# EAGLE design BQ24171_DC (EAGLE 6.6.0)
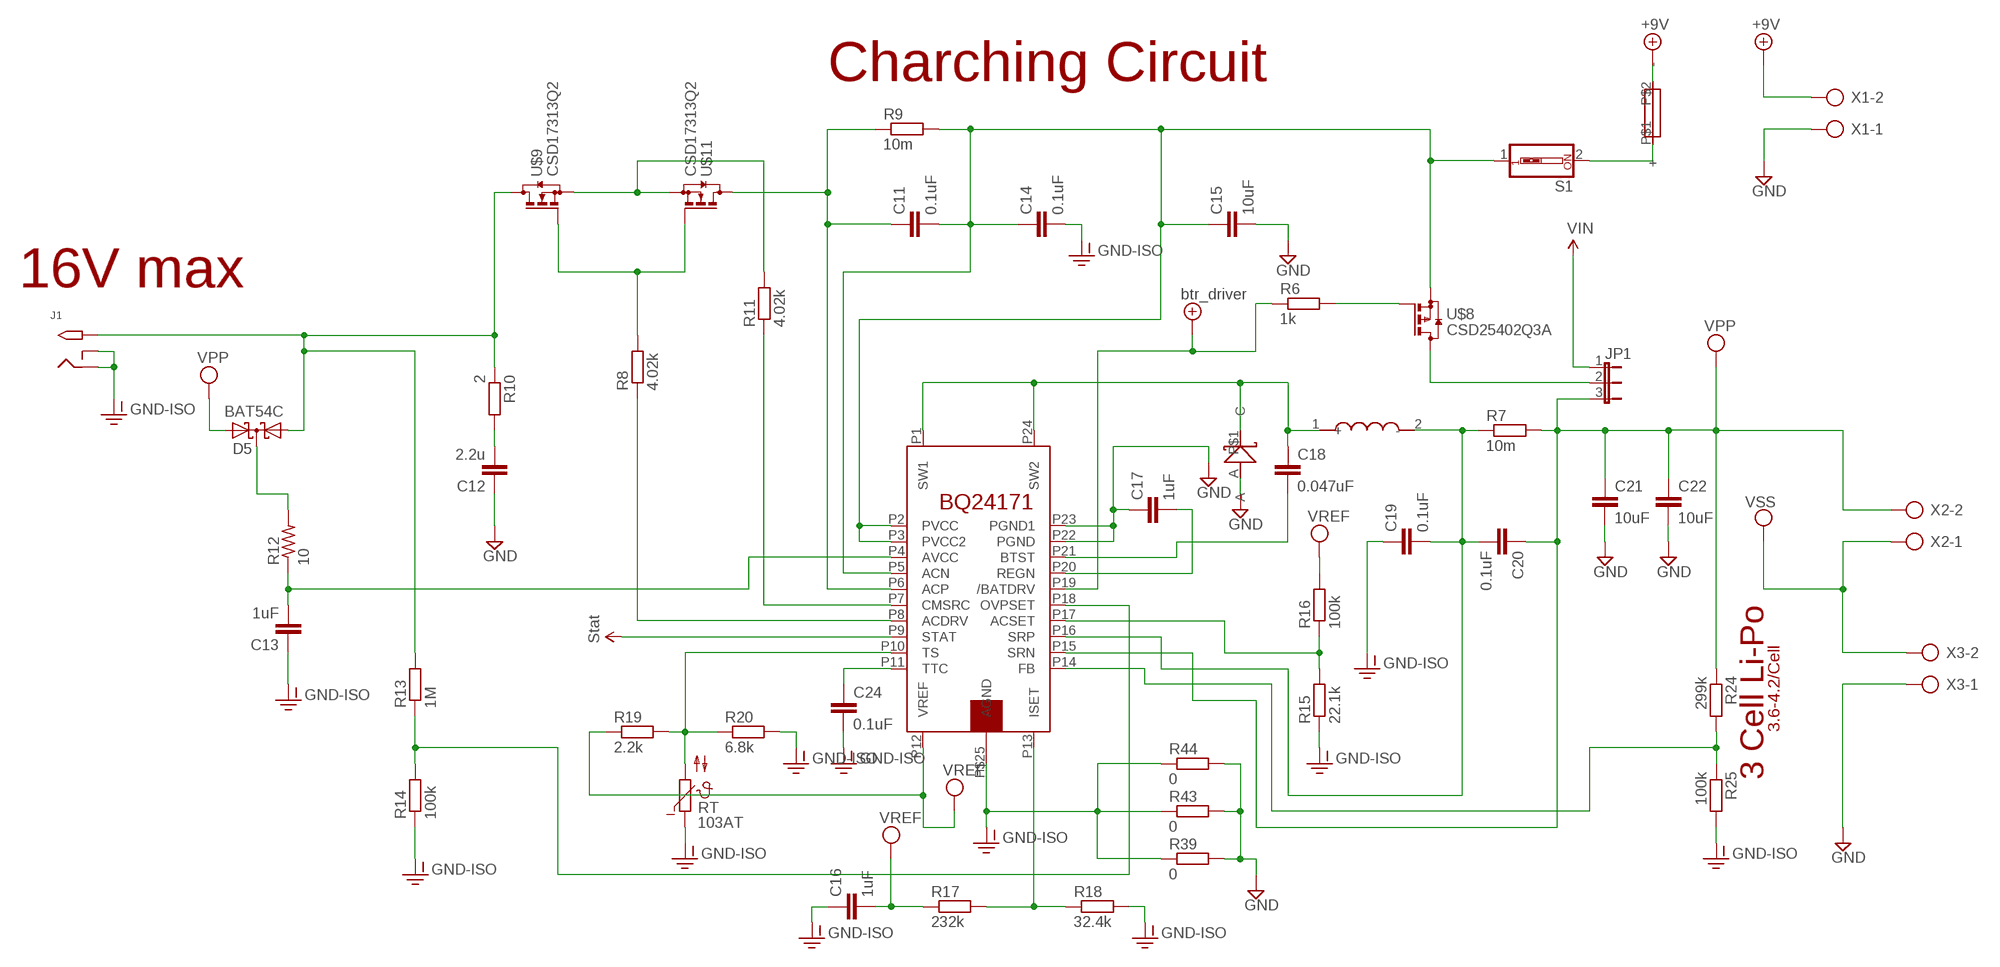
[diagram p0: schematic, sheet 1]

## Parts
B220-1  B220  [SMA]
C11  0.1uF  C-EUC1206  [C1206]
C12  2.2u  C-EUC1206  [C1206]
C13  1uF  C-EUC1206  [C1206]
C14  0.1uF  C-EUC1206  [C1206]
C15  10uF  C-EUC1206  [C1206]
C16  1uF  C-EUC1206  [C1206]
C17  1uF  C-EUC1206  [C1206]
C18  0.047uF  C-EUC1206  [C1206]
C19  0.1uF  C-EUC1206  [C1206]
C20  0.1uF  C-EUC1206  [C1206]
C21  10uF  C-EUC1206  [C1206]
C22  10uF  C-EUC1206  [C1206]
C24  0.1uF  C-EUC1206  [C1206]
D5  BAT54C  [SOT23]
J1  2.1MMJACKTHM  [PJ-102A]
JP1  JP2E  [JP2]
R6  1k  R-EU_M1206  [M1206]
R7  10m  R-EU_R1206  [R1206]
R8  4.02k  R-EU_R1206  [R1206]
R9  10m  R-EU_R1206  [R1206]
R10  2  R-EU_R1206  [R1206]
R11  4.02k  R-EU_R1206  [R1206]
R12  10  R-US_R1206  [R1206]
R13  1M  R-EU_R1206  [R1206]
R14  100k  R-EU_R1206  [R1206]
R15  22.1k  R-EU_R1206  [R1206]
R16  100k  R-EU_M1206  [M1206]
R17  232k  R-EU_R1206  [R1206]
R18  32.4k  R-EU_M1206  [M1206]
R19  2.2k  R-EU_R1206  [R1206]
R20  6.8k  R-EU_R1206  [R1206]
R24  299k  R-EU_R1206  [R1206]
R25  100k  R-EU_R1206  [R1206]
R39  0  R-EU_R1206  [R1206]
R43  0  R-EU_R1206  [R1206]
R44  0  R-EU_R1206  [R1206]
RT  103AT  NTC640  [P640]
S1  SW_DIP-1  [EDG-01]
U$5  BQ24171  [VQFN-N24]
U$7  3.3uH  IHLP-2020CZ-01  [IHLP-202CZ-01]
U$8  CSD25402Q3A  [Q3A]
U$9  CSD17313Q2  [Q2]
U$11  CSD17313Q2  [Q2]
U$17  FUSE  [1808]
X1  AK300/2  [AK300/2]
X2  AK300/2  [AK300/2]
X3  AK300/2  [AK300/2]

## Nets
1.0V: U$5.P9(STAT) ; supply symbol labelled Stat
+9V: U$17.P$2(-) X1.2
+UB: R6.1 U$5.P19(/BATDRV) ; supply symbol labelled btr_driver
AVCC: C13.2 R12.1 U$5.P4(AVCC)
BTST: C18.2 U$5.P21(BTST)
FB: R24.2 R25.1 U$5.P14(FB)
GND: B220-1.A C12.1 C15.2 C17.1 C21.2 C22.2 R39.2 R43.2 R44.2 U$5.P22(PGND) U$5.P23(PGND1) X1.1 X3.1
GND-ISO: C13.1 C14.2 C16.1 C19.1 C24.2 J1.RING J1.RING_SW R14.1 R15.1 R18.2 R20.2 R25.2 R39.1 R43.1 R44.1 RT.1 U$5.P$25(AGND)
ISET: R17.2 R18.1 U$5.P13(ISET)
N$21: JP1.2 U$8.1(D) U$8.2(D) U$8.3(D)
N$25: D5.1(A1) J1.TIP R10.1 R13.2 U$9.1(D) U$9.2(D) U$9.5(D) U$9.6(D) U$9.8(D)
N$28: R15.2 R16.1 U$5.P17(ACSET)
N$30: C11.2 C14.1 C15.1 R9.2 S1.1 U$5.P2(PVCC) U$5.P3(PVCC2) U$5.P5(ACN) U$8.5(S) U$8.6(S) U$8.7(S) U$8.8(S) U$8.P$5(S)
N$32: R6.2 U$8.4(G)
N$38: B220-1.P$1(C) C18.1 U$5.P1(SW1) U$5.P24(SW2) U$7.1(+)
N$40: C19.2 C20.2 R7.1 U$5.P16(SRP) U$7.2(-)
N$42: R8.2 U$9.3(G) U$11.3(G)
N$43: R8.1 U$5.P8(ACDRV)
N$44: R11.2 U$9.4(S) U$9.7(S) U$11.4(S) U$11.7(S)
N$45: C11.1 R9.1 U$5.P6(ACP) U$11.1(D) U$11.2(D) U$11.5(D) U$11.6(D) U$11.8(D)
N$46: C12.2 R10.2
N$48: R11.1 U$5.P7(CMSRC)
N$49: R19.2 R20.1 RT.2 U$5.P10(TS)
N$52: R13.1 R14.2 U$5.P18(OVPSET)
N$66: D5.3(CC) R12.2
N$71: S1.2 U$17.P$1(+)
REGN: C17.2 U$5.P20(REGN)
TTC: C24.1 U$5.P11(TTC)
VEE: C16.2 R16.2 R17.1 R19.1 U$5.P12(VREF) ; supply symbol labelled VREF
VIN: JP1.1
VPP: C20.1 C21.1 C22.1 D5.2(A2) JP1.3 R7.2 R24.1 U$5.P15(SRN) X2.2
VSS: X2.1 X3.2

## Notes on the sheet
- Charching Circuit
- 16V max
- 3.6-4.2/Cell
- 3 Cell Li-Po

## Library data of the parts
B220-1 = Oma:B220
C11-C22 C24 = rcl:C-EU: CAPACITOR, European symbol
D5 = diode:BAT54C: Schottky Diodes Source: Fairchild .. BAT54.pdf
J1 = adafruit:2.1MMJACK: 2.1mm x 5.5mm THM DC jack with internal switch. Digikey part #PJ-102A, 4UCON part #05537 2.1mm x 5.5mm SMT DC jack with internal switch. Digikey part #PJ-002A-SMT, 4UCON part #03267 By microbuilder.eu & adafruit.com
JP1 = jumper:JP2E: JUMPER
R6-R11 R13-R20 R24 R25 R39 R43 R44 = rcl:R-EU_: RESISTOR, European symbol
R12 = resistor:R-US_: RESISTOR, American symbol
RT = ptc-ntc:NTC640: PHILIPS NTC; OC_FARNELL: unknown; OC_NEWARK: unknown
S1 = special:SW_DIP-1: DIP SWITCH
U$5 = ReskiT:BQ24171
U$7 = Oma:IHLP-2020CZ-01
U$8 = Oma:CSD25402Q3A
U$9 U$11 = Oma:CSD17313Q2
U$17 = Oma:FUSE
X1-X3 = con-ptr500:AK300/2: CONNECTOR; OC_FARNELL: unknown; OC_NEWARK: unknown

## Board
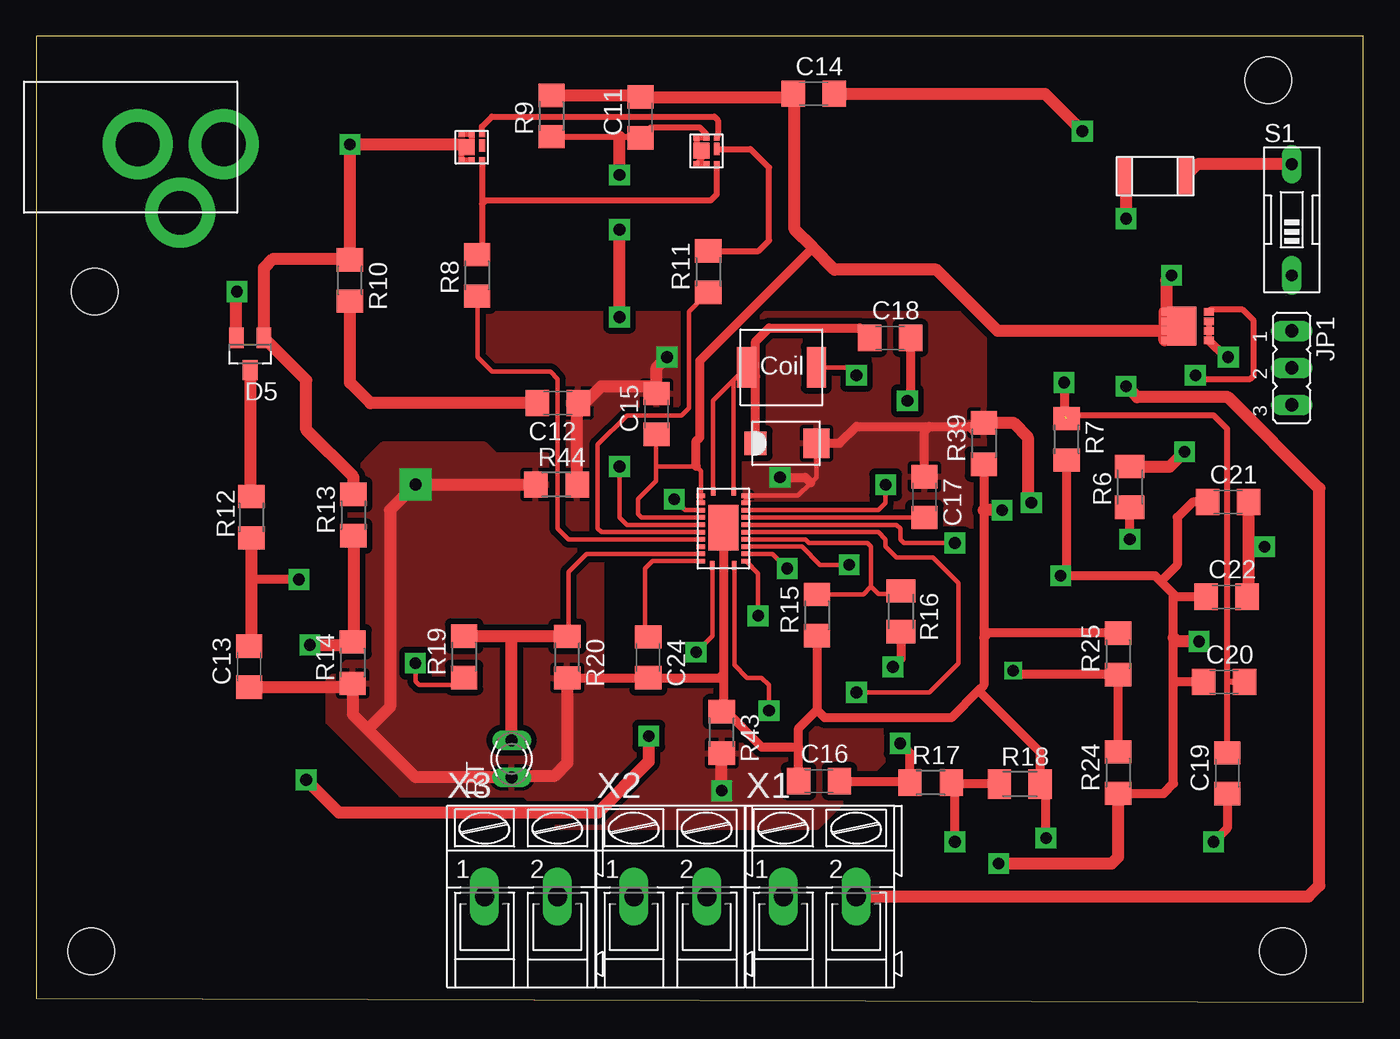
[diagram p1: board, top side]
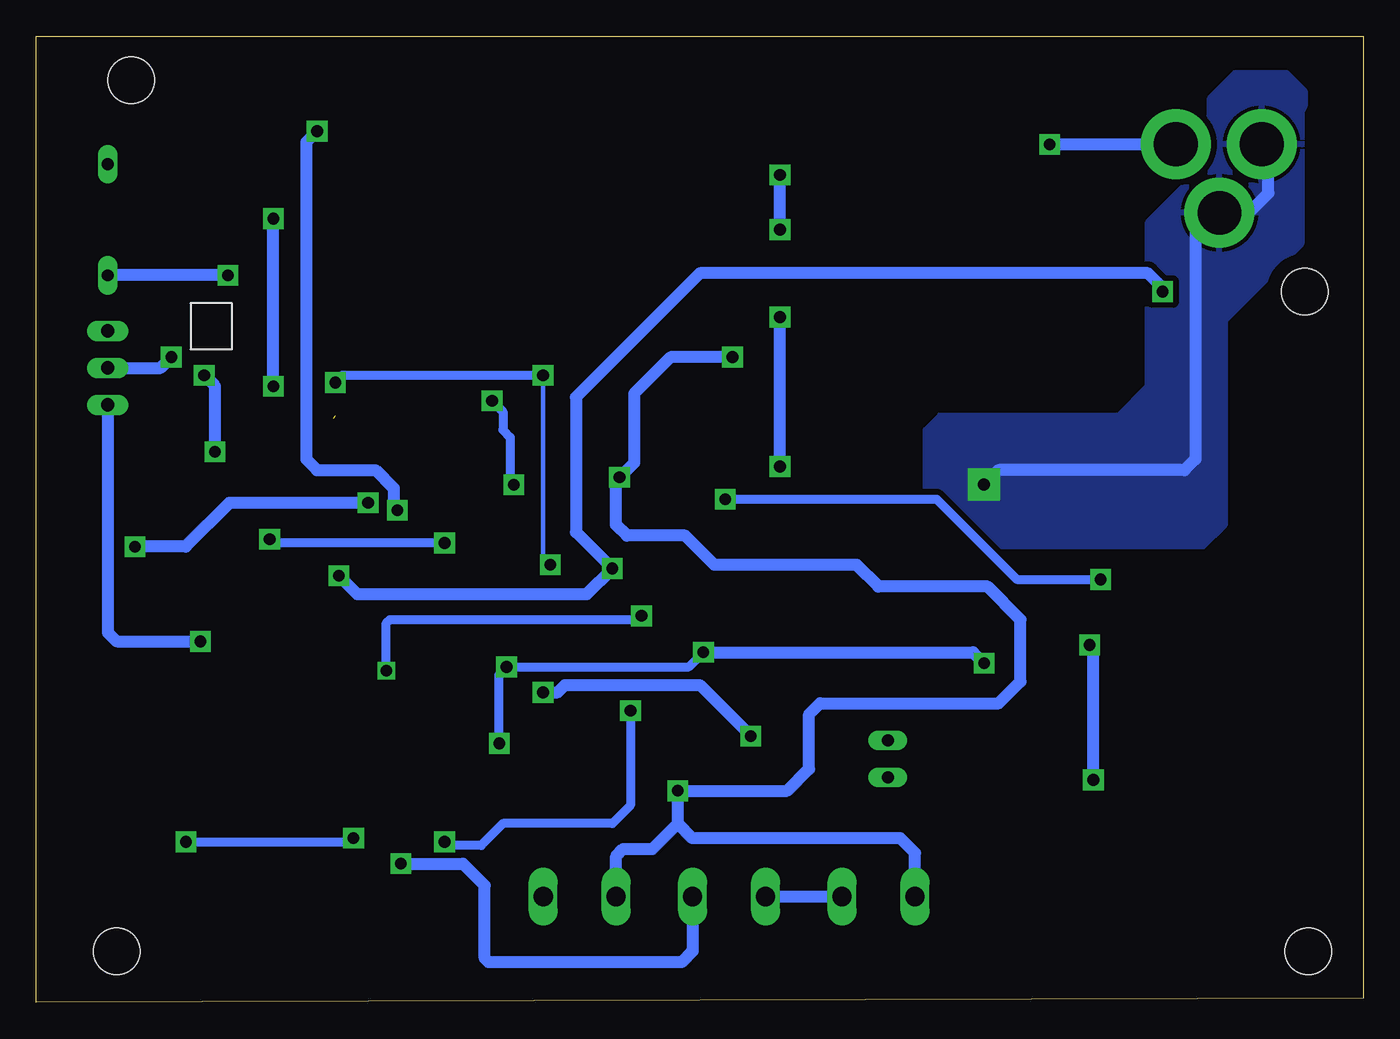
[diagram p2: board, bottom side, seen from below]

Size 91 x 66.25 mm. Coordinates in mm from the lower left corner, seen from the top.
Outline: 0,0.25 91,0 91,66.25 0,66.25 0,0.25
Copper layers (1*16): Top 0.035mm / dielectric 1.5mm / Bottom 0.035mm
Design rules "default": minimum track width 10mil, minimum drill 24mil, track to track 8mil, track to pad 8mil, pad to pad 8mil, via to via 8mil, smd to smd 8mil, copper to edge 40mil, drill to drill 8mil, minimum pad ring 10mil, minimum via ring 8mil, stop-mask expansion 4mil, vias tented up to drill 0mil, thermal gap 10mil
Holes 3.2 mm at 3.75,3.5 4,48.75 84.5,63.25 85.5,3.5

### Footprints (pad centres in the part's own frame; a part is rotated, then mirrored left to right if it is on the bottom)
SMA = smd 1.8 x 2: A 2.09,0 | smd 1.52 x 1.63: P$1 -2.09,0
C1206 = smd 1.6 x 1.8: 1 -1.4,0; 2 1.4,0
SOT23 = smd 1 x 1.4: 1 -0.95,-1.1; 2 0.95,-1.1; 3 0,1.1
PJ-102A = drill 3 pad 4.8: RING 0.1,-3.39; RING_SW -4.6,-6.29; TIP 0.1,-9.29
JP2 = drill 0.914 long: 1 -2.54,0; 2 0,0; 3 2.54,0
M1206 = smd 1.6 x 2: 1 -1.4,0; 2 1.4,0
R1206 = smd 1.6 x 1.803: 1 -1.422,0; 2 1.422,0
P640 = drill 0.813 long: 1 -1.27,0; 2 1.27,0
EDG-01 = drill 0.813 long: 1 0,-3.81; 2 0,3.81
VQFN-N24 = smd 0.61 x 0.305: P1 0.2,1.05; P12 5.3,1; P13 5.3,2.5; P24 0.2,2.45 | smd 0.305 x 0.61: P2 0.5,0.2; P3 1,0.2; P4 1.5,0.2; P5 2,0.2; P6 2.5,0.2; P7 3,0.2; P8 3.5,0.2; P9 4,0.2; P10 4.5,0.2; P11 5,0.2; P14 5,3.3; P15 4.5,3.3; P16 4,3.3; P17 3.5,3.3; P18 3,3.3; P19 2.5,3.3; P20 2,3.3; P21 1.5,3.3; P22 1,3.3; P23 0.5,3.3 | smd 3.1 x 2.05: P$25 2.7,1.75
IHLP-202CZ-01 = smd 1.3 x 2.79: 1 0.6,0; 2 5.4,0
Q3A = smd 0.5 x 0.68 bottom: 1 2.15,0.26; 2 1.5,0.26; 3 0.85,0.26; 4 0.2,0.26 | smd 0.5 x 0.41 bottom: 5 0.2,3.3; 6 0.85,3.3; 7 1.5,3.3; 8 2.15,3.3 | smd 2.65 x 2.01 bottom: P$5 1.175,2.11
Q2 = smd 0.4 x 0.455: 1 0.2,0.245; 2 0.9,0.245; 3 1.6,0.245; 4 1.6,2.1; 5 0.9,2.1; 6 0.2,2.1 | smd 0.4 x 0.85: 7 1.6,1.3 | smd 1.1 x 1.1: 8 0.55,1.173
1808 = smd 1.1 x 2.5: P$1 -2.14,0 | smd 1 x 2.5: P$2 2.04,0
AK300/2 = drill 1.321 long: 1 -2.515,0; 2 2.489,0

### Placement (x,y rotation side)
B220-1  51.42,38.34 0 top
C11  41.43,60.69 90 top
C12  35.76,41.09 180 top
C13  14.59,23.01 90 top
C14  53.32,62.32 0 top
C15  42.54,40.35 90 top
C16  53.68,15.16 0 top
C17  60.91,34.65 270 top
C18  58.56,45.57 0 top
C19  81.68,15.7 90 top
C20  81.47,21.96 0 top
C21  81.74,34.31 0 top
C22  81.64,27.81 0 top
C24  41.96,23.65 270 top
D5  14.66,44.46 180 top
J1  3.56,58.75 90 top
JP1  86.11,43.51 270 top
R6  74.99,35.34 90 top
R7  70.66,38.61 270 top
R8  30.23,49.86 90 top
R9  35.34,60.79 90 top
R10  21.51,49.51 270 top
R11  46.08,50.11 90 top
R12  14.74,33.26 90 top
R13  21.74,33.41 90 top
R14  21.69,23.29 90 top
R15  53.54,26.55 90 top
R16  59.31,26.81 270 top
R17  61.34,15.06 0 top
R18  67.45,14.96 0 top
R19  29.34,23.69 90 top
R20  36.41,23.66 270 top
R24  74.19,15.74 90 top
R25  74.19,23.89 90 top
R39  64.99,38.33 90 top
R43  47.01,18.5 270 top
R44  35.67,35.51 0 top
RT  32.6,16.69 90 top
S1  86.11,53.67 0 top
U$5  45.37,35.25 270 top
U$7  48.1,43.55 0 top
U$8  80.68,47.55 270 bottom
U$9  28.96,57.48 0 top
U$11  45.06,57.23 0 top
U$17  76.68,56.66 180 top
X1  53.75,7.25 0 top
X2  43.5,7.25 0 top
X3  33.25,7.25 0 top

### Tracks (layer width: path | path; a pad name or v marks a point on that pad's centre or on a via)
+9V  (via drill 0.8 pad 1.42)
  Top 0.813: X1.2 87.25,7.25 88,8 88,35.25 81.75,41.5 75.5,41.5 v74.75,42.25 | v74.75,53.75 74.75,56.55 U$17.P$2
  Bottom 0.813: v74.75,42.25 v74.75,53.75
+UB  (via drill 0.8 pad 1.42)
  Top 0.305: U$5.P19 59,32.75 59.25,32.5 59.25,31.75 59.5,31.5 v63,31.5
  Top 0.61: v75,31.75 75,32.68 R6.1
  Bottom 0.61: v63,31.5 74.75,31.5 v75,31.75
AVCC  (via drill 0.8 pad 1.42)
  Top 0.305: U$5.P4 44.5,33.75 v43.75,34.5
  Top 0.61: v18,29 14.74,29
  Top 0.813: R12.1 14.74,29 14.74,24.56 C13.2
  Bottom 0.61: v18,29 23.75,29 29.25,34.5 v43.75,34.5
BTST  (via drill 0.8 pad 1.42)
  Top 0.305: U$5.P21 57.75,33.75 58.25,34.25 v58.25,35.5
  Top 0.61: C18.2 59.96,41.46 v59.75,41.25
  Bottom 0.61: v59.75,41.25 59,40.5 59,39.25 58.5,38.75 58.5,35.75 v58.25,35.5
FB  (via drill 0.8, 0.8 pad 1.42)
  Top 0.305: v49.5,26.5 49.5,29.42 U$5.P14
  Top 0.61: R24.2 R25.1 67.28,22.47 v67,22.75
  Bottom 0.61: v67,22.75 67,26 66.75,26.25 49.75,26.25 v49.5,26.5
GND  (via drill 0.8 pad 1.42)
  Top 0.305: B220-1.A 53.5,36 53.12,35.62 52.25,34.75 U$5.P23 U$5.P22
  Top 0.61: B220-1.A 55.09,38.34 56.25,39.5 61.25,39.5 | 61.25,39.5 64,39.5 64.25,39.25 64.49,39.25 R39.2 | C17.1 60.91,39.16 61.25,39.5 | v51,36 52.75,36 53.12,35.62
  Top 0.813: R44.2 37.09,41.02 C12.1 37.59,41.09 38.75,42.25 42.04,42.25 C15.2 42.54,43.54 v43.25,44.25 | C21.2 83.14,31.25 | 83.14,31.25 83.14,27.91 C22.2 | R39.2 67,39.75 68,38.75 68,34.5 v68.25,34.25 | v84.25,31.25 83.14,31.25 | v47,14.5 47,17.07 R43.2
  Bottom 0.813: v43.25,44.25 47.5,44.25 50,41.75 50,37 v51,36 51.25,35.75 51.25,32.75 50.5,32 46.5,32 44.5,30 34.75,30 33.25,28.5 25.75,28.5 23.5,26.25 23.5,22 25,20.5 37.25,20.5 38,19.75 38,16 39.5,14.5 v47,14.5 47,12.25 | v68.25,34.25 77.75,34.25 80.75,31.25 v84.25,31.25 | X1.1 51.23,10.02 50.75,10.5 48.75,10.5 47,12.25 | X3.1 30.73,10.23 31.75,11.25 46,11.25 47,12.25
  pour Top (isolate 0.406): 29,43.25 29,45.5 30.75,47.25 63.25,47.25 65,45.5 65,26 64,25 64,22.5 53.5,12 35.75,12 29.5,18.25 29.5,41.5 29,42
GND-ISO  (via drill 0.8 pad 1.42, 0.8 pad 2.18)
  Top 0.61: U$5.P$25 47.12,22.5 | 47.12,22.5 47.12,20.03 | 47.12,20.03 R43.1 47.09,20 | 47.12,22.5 46.87,22.25 C24.2 41.95,22.24 R20.2 | R39.1 64.99,33.75 64.99,25 | 64.99,25 64.99,21.74 64.62,21.38 | 64.62,21.38 62.75,19.5 54.08,19.5 53.54,20.04 | R15.1 53.54,20.04 | R25.2 65.3,25.31 64.99,25 | 64.62,21.38 68.85,17.15 R18.2 69.25,14.56 v69.25,11.25 | C19.1 81.68,11.93 v80.75,11 | C16.1 52.28,17.5 | 52.28,17.5 52.28,18.78 53.54,20.04 | 47.12,20.03 47.22,20.03 49.75,17.5 52.28,17.5
  Top 0.813: R20.2 36.41,16.41 35.5,15.5 32.68,15.5 RT.1 26.02,15.42 22.72,18.72 | 22.72,18.72 21.69,19.75 R14.1 21.43,21.61 C13.1 | 22.72,18.72 24.25,20.25 24.25,33.75 v26.01,35.51 R44.1 | C14.2 69.18,62.32 v71.75,59.75 | v66.25,33.75 64.99,33.75
  Bottom 0.61: v80.75,11 69.5,11 v69.25,11.25
  Bottom 0.813: J1.RING 6.5,58.4 6.5,55.5 7.85,54.15 J1.RING_SW 10.85,54.15 11.5,53.5 11.5,37.25 12.25,36.5 25.02,36.5 v26.01,35.51 | v71.75,59.75 72.5,59 72.5,37.25 71.75,36.5 67.75,36.5 66.5,35.25 66.5,34 v66.25,33.75
  pour Bottom (isolate 0.406): 4.25,61 4.25,52 9.5,46.75 9.5,32.75 11,31.25 26,31.25 30,35.25 30,39.25 29,40.25 16.75,40.25 14.75,42.25 14.75,53.5 10.5,57.75 10.5,62 8.75,63.75 5.25,63.75 4,62.5 4,61.5
  pour Top (isolate 0.406): 34.75,37.5 31.5,37.5 30.75,38.25 23.75,38.25 21.5,36 21.5,23.5 20,22 20,19.25 25,14.25 37.75,14.25 38.75,15.25 38.75,33.75 35,37.5
ISET  (via drill 0.8 pad 1.42)
  Top 0.305: U$5.P13 47.87,23.13 48.75,22.25 49.75,22.25 50.25,21.75 v50.25,20
  Top 0.61: v63,11 63,14.5 | 63,14.5 63,14.82 R17.2 | R18.1 63.46,14.96 63,14.5
  Bottom 0.61: v63,11 62.75,10.75 60.5,10.75 59,12.25 51.5,12.25 50.25,13.5 v50.25,20
N$21  (via drill 0.8 pad 1.42)
  Top 0.406: U$8.3 U$8.2 U$8.1
  Top 0.61: v81.75,44.25 81.57,44.25 U$8.1
  Bottom 0.813: JP1.2 82.49,43.51 v81.75,44.25
N$25  (via drill 0.8 pad 1.42)
  Top 0.406: U$9.2 U$9.1 29.16,58.3 U$9.8 29.86,59 U$9.5 U$9.6
  Top 0.813: U$9.8 29.31,58.85 v21.5,58.85 v21.51,58.84 R10.1 21.44,51 16.25,51 15.61,50.36 D5.1 18.5,42.67 18.5,39.25 21.74,36.01 R13.2
  Bottom 0.813: v21.5,58.85 J1.TIP
N$28
  Top 0.305: U$5.P17 52.75,31.75 53,31.5 57,31.5 57.25,31.25 57.25,28.5 | 57.25,28.5 57.75,28 59.1,28 R16.1 | R15.2 56.72,27.97 57.25,28.5
N$30  (via drill 0.8 pad 1.42)
  Top 0.305: 42.5,36.75 42.5,35.75 41.25,34.5 41.25,33.5 41.5,33.25 U$5.P5 | 42.5,36.75 42.5,38.91 C15.1 | U$5.P3 U$5.P2 45.57,36.43 45.25,36.75 42.5,36.75
  Top 0.61: 45.25,36.75 45.25,38.5 45.5,38.75 45.5,44 53.25,51.75
  Top 0.813: R9.2 41.31,62.21 C11.2 51.69,62.09 C14.1 52,62.24 52,53 53.25,51.75 54.75,50.25 61.75,50.25 65.95,46.05 U$8.7 | U$8.P$5 77.7,46.38 U$8.7 | U$8.8 U$8.7 | U$8.5 U$8.6 | U$8.6 U$8.7 | v77.86,49.86 77.5,49.5 77.5,46.82 U$8.6
  Bottom 0.813: v77.86,49.86 S1.1
N$32  (via drill 0.8 pad 1.42)
  Top 0.406: U$8.4 80.52,47.5 82.75,47.5 83.5,46.75 83.5,43 83.25,42.75 80,42.75 79.75,43 v79.5,43
  Top 0.813: R6.2 77.74,36.74 v78.75,37.75
  Bottom 0.813: v78.75,37.75 78.75,42.25 v79.5,43
N$38
  Top 0.305: U$5.P24 47.82,42.67 | 47.82,42.67 U$7.1 | U$5.P1 46.42,41.27 47.82,42.67
  Top 0.61: B220-1.P$1 49.33,42.92 | 49.33,42.92 U$7.1 | 49.33,42.92 49.33,45.33 50.25,46.25 56.48,46.25 C18.1
N$40  (via drill 0.8 pad 1.42)  (1 unrouted)
  Top 0.305: U$7.2 55.7,43.55 v56.25,43 | U$5.P16 52.5,31.25 53.75,30 v55.75,30
  Top 0.406: R7.1 70.88,40.25 80.75,40.25 81.68,39.32 81.68,22 | C19.2 81.68,22 | C20.2 81.72,21.96 81.68,22
  Top 0.61: v70.5,42.5 70.5,40.19
  Bottom 0.305: v56.25,43 56.25,30.5 v55.75,30
  Bottom 0.61: v56.25,43 70,43 v70.5,42.5
N$42
  Top 0.406: U$9.3 30.56,54.75 | 30.56,54.75 30.56,51.61 R8.2 | U$11.3 46.66,55.41 46.25,55 30.81,55 30.56,54.75
N$43
  Top 0.305: U$5.P8 36.5,31.75 35.75,32.5 35.75,42.75 35.25,43.25 31.25,43.25 30.25,44.25 30.25,48.42 R8.1
N$44
  Top 0.406: R11.2 49.53,51.53 50.25,52.25 50.25,57.25 48.97,58.53 U$11.7 | U$9.4 30.56,60.06 31.25,60.75 46.5,60.75 46.75,60.5 46.75,59.42 U$11.4
N$45  (via drill 0.8 pad 1.42)
  Top 0.305: U$5.P6 40.5,32.75 40,33.25 v40,36.75
  Top 0.406: U$11.2 U$11.1 45.61,57.83 U$11.8 45.26,58.75 U$11.6 U$11.5 45.96,59.54 45.5,60 42.14,60 C11.1 41.35,59.37 40,59.37 R9.1
  Top 0.813: v40,47 v40,53 | v40,56.75 40,59.37
  Bottom 0.813: v40,36.75 v40,47 | v40,53 v40,56.75
N$46
  Top 0.813: C12.2 22.91,41.09 21.5,42.5 21.5,48.08 R10.2
N$48
  Top 0.305: U$5.P7 38.75,32.25 38.5,32.5 38.5,38.25 40.5,40.25 44.25,40.25 44.75,40.75 44.75,47.36 R11.1
N$49
  Top 0.305: U$5.P10 37.75,30.75 36.5,29.5 36.5,25.17 R20.1
  Top 0.813: R19.2 32.75,25.11 | 32.75,25.11 36.38,25.11 R20.1 | RT.2 32.6,24.96 32.75,25.11
N$52  (via drill 0.8 pad 1.42)
  Top 0.305: U$5.P18 57.75,32.25 58.25,31.75 58.25,31.25 59,30.5 61.5,30.5 63.25,28.75 63.25,23.25 61.25,21.25 v56.25,21.25
  Top 0.813: R13.1 21.74,24.76 R14.2 21.48,24.5 v18.75,24.5 | v42,18.25 42,16.5 38.5,13 20.75,13 v18.5,15.25
  Bottom 0.813: v42,18.25 45.5,21.75 54.75,21.75 55.25,21.25 v56.25,21.25 | v18.5,15.25 18.5,24.25 v18.75,24.5
N$66
  Top 0.813: D5.3 14.66,34.76 R12.2
N$71
  Top 0.813: S1.2 79.64,57.48 U$17.P$1
REGN
  Top 0.305: U$5.P20 C17.2
TTC
  Top 0.305: U$5.P11 42.25,30.25 41.75,29.75 41.75,25.26 C24.1
VEE  (via drill 0.8 pad 1.42)
  Top 0.305: U$5.P12 46.37,25.12 v45.25,24 | v26,23.25 26,22 26.25,21.75 28.82,21.75 R19.1
  Top 0.61: R16.2 59.31,23.56 v58.75,23 | C16.2 59.82,15.16 R17.1 59.92,17.08 v59.25,17.75
  Bottom 0.61: v45.25,24 46.25,23 v58.75,23 59.25,22.5 v59.25,17.75
  Bottom 0.813: v45.25,24 26.75,24 v26,23.25
VPP  (via drill 0.8 pad 1.42)
  Top 0.305: v51.5,29.75 50.5,30.75 U$5.P15
  Top 0.406: 78.06,24.56 78,24.5
  Top 0.61: R7.2 70.66,29.66 v70.25,29.25 76.75,29.25 77.12,28.88 | R24.1 77.32,14.32 78,15 78,21.75 | 78,21.75 78,24.5 78,25 78,28 | 78,28 77.12,28.88 | C20.1 78.21,21.96 78,21.75 | C22.1 78.19,27.81 78,28 | C21.1 79.31,34.31 78.25,33.25 78.25,30 77.12,28.88
  Top 0.813: D5.2 13.71,48.71 v13.75,48.75 | R24.1 74.19,9.94 73.75,9.5 v66,9.5 | v79.75,24.75 78.25,24.75 78,25
  Bottom 0.61: 52,29.25 v51.5,29.75
  Bottom 0.813: v13.75,48.75 13.75,49 14.75,50 45.5,50 54,41.5 54,32.25 v51.5,29.75 53.25,28 69,28 v70.25,29.25 | v66,9.5 61.75,9.5 60.25,8 60.25,3 60,2.75 46.75,2.75 45.99,3.51 X2.2 | JP1.3 86.11,25.36 85.5,24.75 v79.75,24.75
VSS
  Bottom 0.813: X2.1 X3.2